# Altium project PCB_Project.PrjPcb
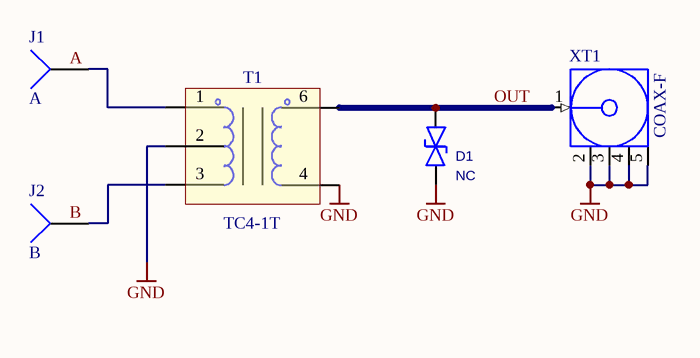
[diagram p0: balun.SchDoc]
1 sheet, 5 parts. Net scope: global (net labels, ports and power ports of the same name join across sheets).
Board file: PCB.PcbDoc

## Sheet balun.SchDoc
size A4

### Parts
D1  NC  [SOD-323]
J1  A  [PIN1]
J2  B  [PIN1]
T1  TC4-1T  [AT224]
XT1  COAX-F  [SMA-16]

### Nets
GND: D1.1 T1.2 T1.4 XT1.2(GND) XT1.3(GND) XT1.4(GND) XT1.5(GND)
OUT: D1.2 T1.6 XT1.1(Signal)
NetJ1_1: J1.1 T1.1
NetJ2_1: J2.1 T1.3

### Notes on the sheet
- Labels drawn without touching a wire or pin: A, B

### Library data of the parts
D1 = TVS_BIDIR: TVS Diodes; Value: NC
J1 J2 = Socket: LatestRevisionDate: 17-Jul-2002; LatestRevisionNote: Re-released for DXP Platform.; Publisher: Altium Limited
T1 = TC4-1T: RF TRANSFORMERS WIDEBAND; value: TC4-1T
XT1 = COAX-F: RF Coaxial PCB Connector, MCX; Thru-Hole, Right-Angle Mount Socket, Blunt Post Terminal, 50 Ohm Impedance; PCB_Layout: Complies with manufacturer's recommendation.; DrillSize: Corresponds to nominal value.; Published: 15-Jul-2004; LatestRevisionDate: 15-Jul-2004; LatestRevisionNote: Component Replaced.; DatasheetDocument: 30-May-2003; PackageDocument: 04-Jul-1999; PackageReference: 919-119J-51AX; Publisher: Altium Limited; ComponentLink1Description: Manufacturer Link; ComponentLink1URL: http://www.amphenolrf.com/